# EAGLE design ModMoPSS - IR receiver (EAGLE 9.6.2)
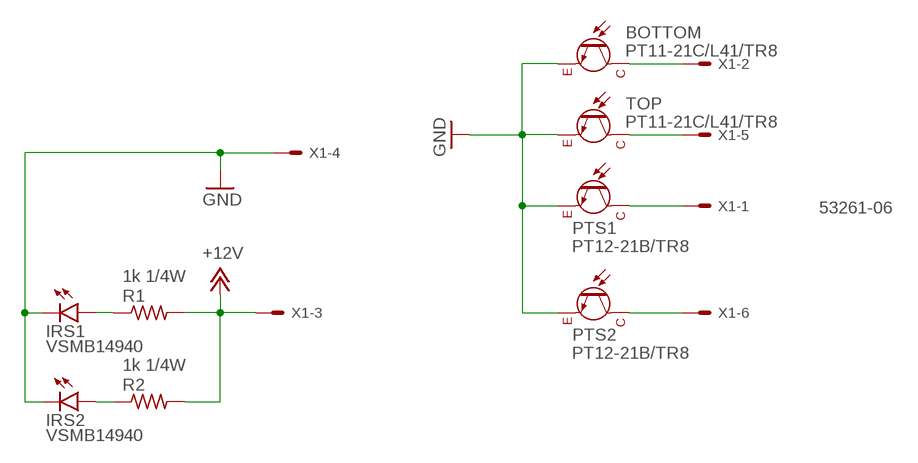
[diagram p0: schematic, sheet 1]

## Parts
BOTTOM  PT11-21C/L41/TR8  [CHIPLED_1206]
IRS1  VSMB14940  [VSMB14940]
IRS2  VSMB14940  [VSMB14940]
PTS1  PT12-21B/TR8  [PT12-21B/TR8]
PTS2  PT12-21B/TR8  [PT12-21B/TR8]
R1  1k 1/4W  R-US_R0805  [R0805]
R2  1k 1/4W  R-US_R0805  [R0805]
TOP  PT11-21C/L41/TR8  [CHIPLED_1206]
X1  53261-06  [53261-06]

## Nets
+12V: R1.2 R2.2 X1.3
GND: BOTTOM.A(E) IRS1.P$2(C) IRS2.P$2(C) PTS1.P$2(E) PTS2.P$2(E) TOP.A(E) X1.4
N$1: BOTTOM.C X1.2
N$2: PTS1.P$1(C) X1.1
N$3: TOP.C X1.5
N$4: IRS2.P$1(A) R2.1
N$5: PTS2.P$1(C) X1.6
N$7: IRS1.P$1(A) R1.1

## Library data of the parts
BOTTOM TOP = 000-my_library:PT11-21C/L41/TR8: IR photodiode 1206 jlcpcb
IRS1 IRS2 = 000-my_library:VSMB14940
PTS1 PTS2 = 000-my_library:PT12-21B/TR8
R1 R2 = rcl:R-US_: RESISTOR, American symbol; SPICEPREFIX: R
X1 = con-molex:53?-06: CONNECTOR wire to board 1.25 mm (.049 inch) pitch header; MF: MOLEX; OC_FARNELL: 1125375; OC_NEWARK: unknown

## Board
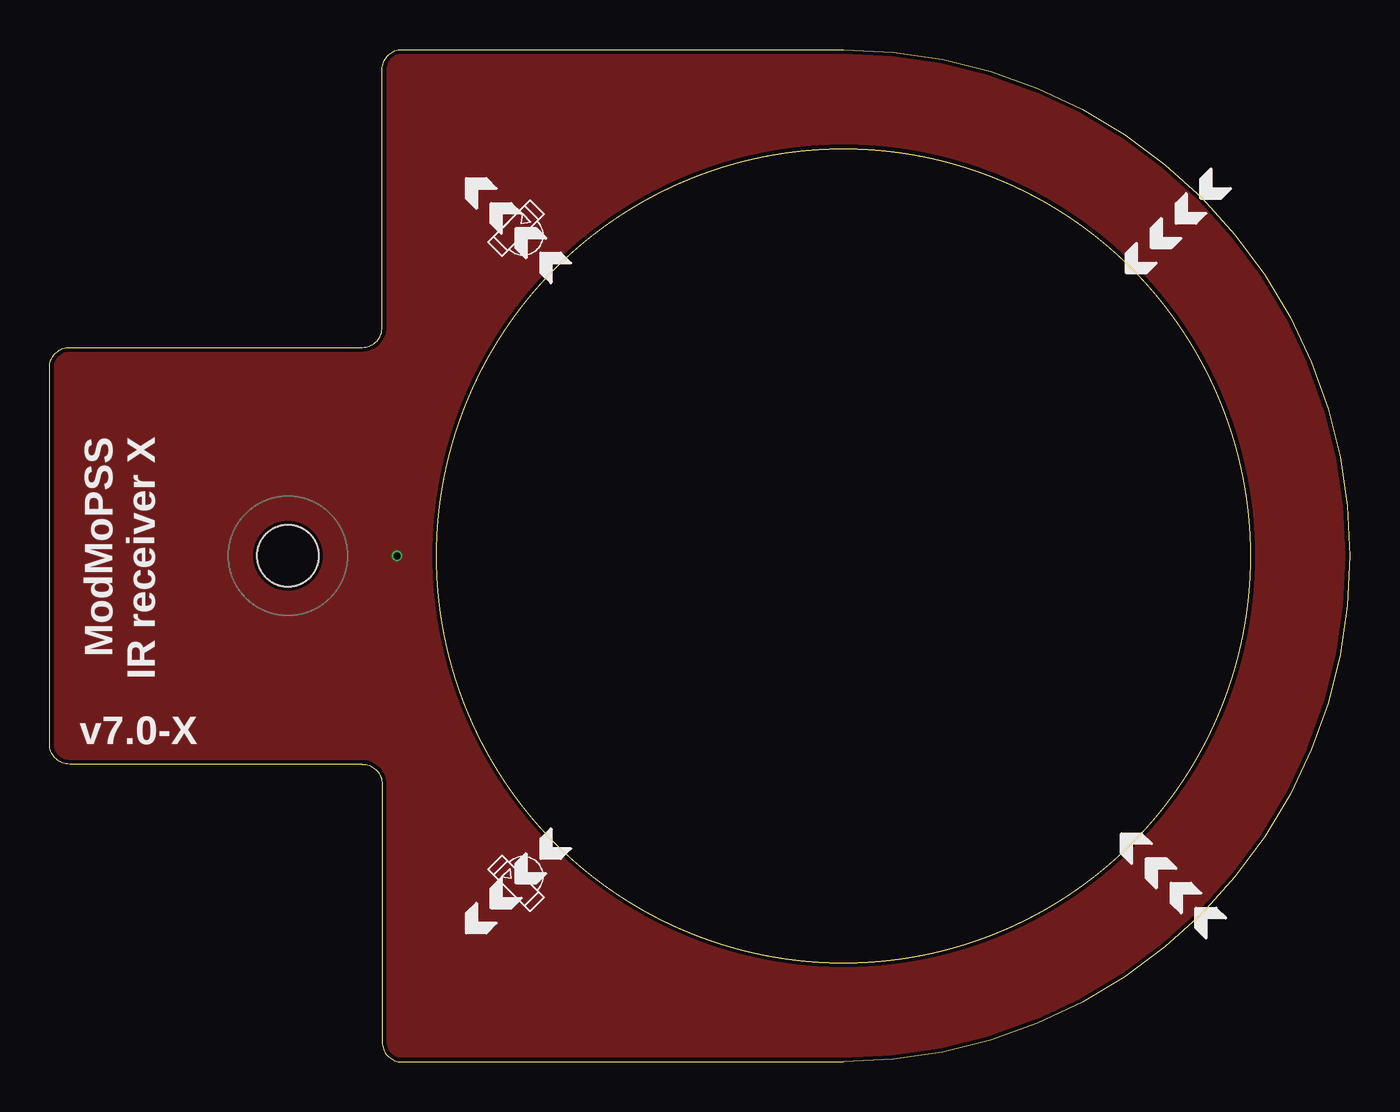
[diagram p1: board, top side]
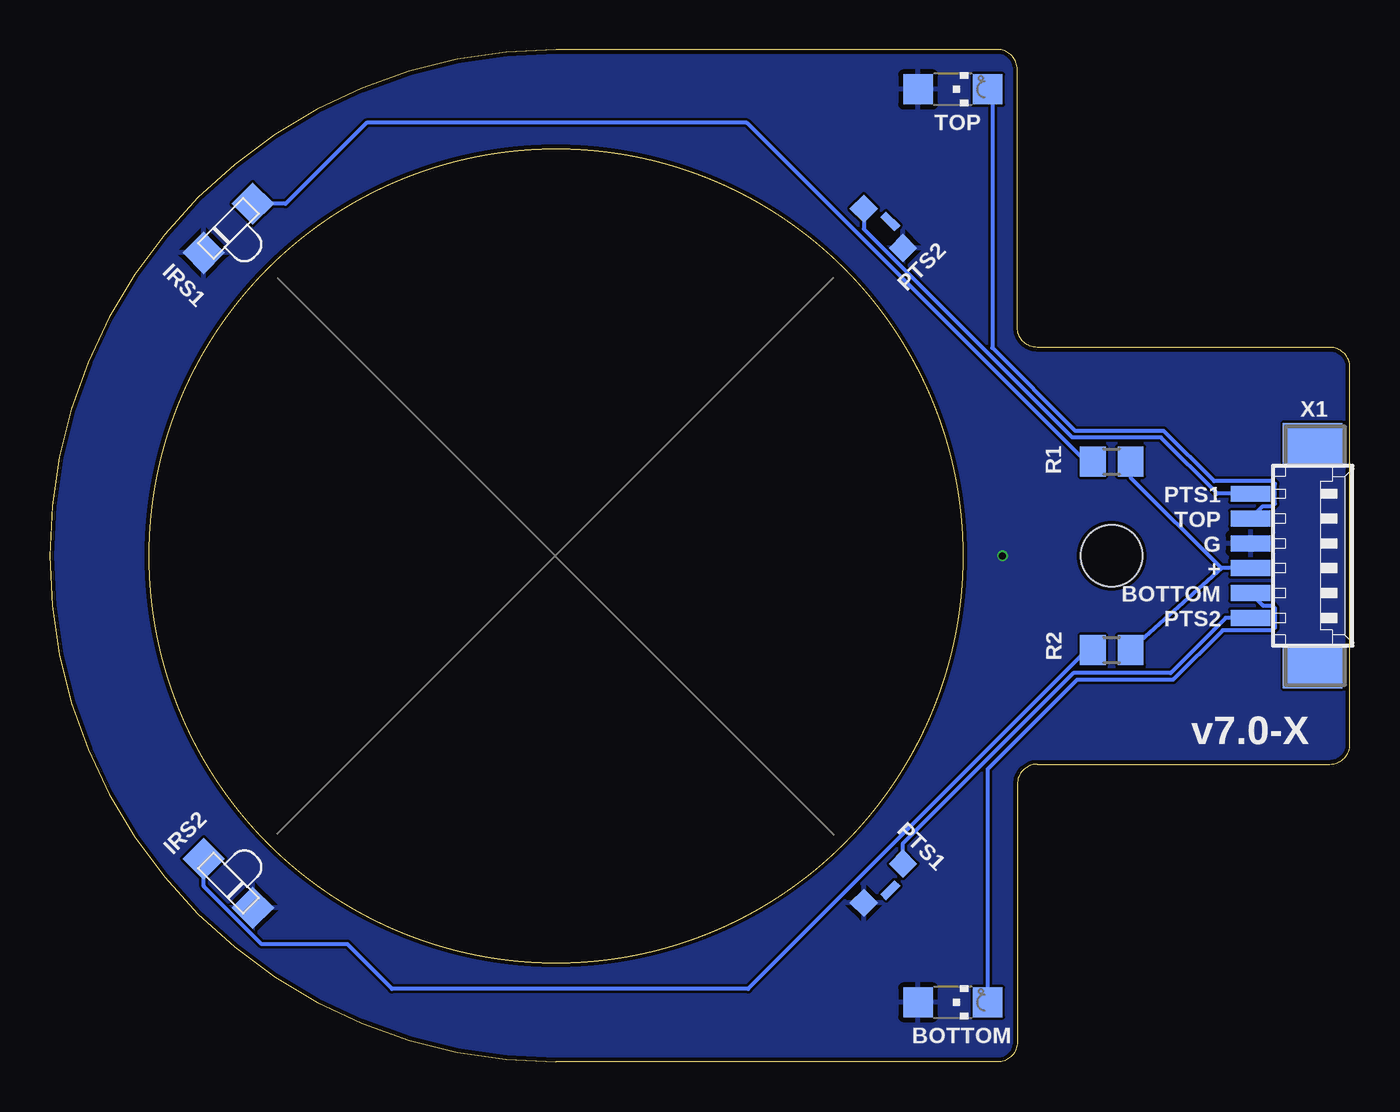
[diagram p2: board, bottom side, seen from below]

Size 65.5 x 51 mm. Coordinates in mm from the lower left corner, seen from the top.
Outline: 15.75,15 1,15 arc-90 0,16 0,35 arc-90 1,36 15.75,36 arc90 16.75,37 16.75,50 arc-90 17.75,51 40,51 arc-180 40,0 17.75,0 arc-90 16.75,1 16.75,14 arc90 15.75,15
Outline: circle at 40,25.5 radius 20.5
Copper layers (1*16): Top 0.035559375mm / dielectric 1.6mm / Bottom 0.035559375mm
Design rules "jlcpcb2layer": minimum track width 5mil, minimum drill 12mil, track to track 5mil, track to pad 5mil, pad to pad 5mil, via to via 5mil, smd to smd 5mil, copper to edge 8mil, drill to drill 6mil, minimum pad ring 5mil, minimum via ring 3mil, stop-mask expansion 2.5mil, vias tented up to drill 0mil, thermal gap 10mil
Holes 3.1 mm at 12,25.5

### Footprints (pad centres in the part's own frame; a part is rotated, then mirrored left to right if it is on the bottom)
CHIPLED_1206 = smd 1.5 x 1.5: A 0,-1.75; C 0,1.75
VSMB14940 = smd 1.5 x 1.5: P$1 -1.75,0; P$2 1.75,0
PT12-21B/TR8 = smd 1 x 1: P$1 1.4,0; P$2 -1.4,0 | smd 1 x 0.4: P$3 0,-0.5
R0805 = smd 1.3 x 1.5: 1 -0.95,0; 2 0.95,0
53261-06 = smd 0.8 x 2: 1 3.125,-2.5; 2 1.875,-2.5; 3 0.625,-2.5; 4 -0.625,-2.5; 5 -1.875,-2.5; 6 -3.125,-2.5 | smd 2.1 x 3: S1 5.625,0.625; S2 -5.625,0.625

### Placement (x,y rotation side)
BOTTOM  20,3 270 bottom
IRS1  56.5,42 225 bottom
IRS2  56.5,9 315 bottom
PTS1  23.5,9 45 bottom
PTS2  23.5,42 135 bottom
R1  12,30.25 0 bottom
R2  12,20.75 0 bottom
TOP  20,49 270 bottom
X1  2.5,25.5 270 bottom

### Tracks (layer width: path | path; a pad name or v marks a point on that pad's centre or on a via)
+12V
  Bottom 0.203: R2.2 6.45,24.88 X1.3 6.47,24.88 11.05,29.45 R1.2
GND  (via drill 0.35)
  other vias: 17.5,25.5
  pour Bottom: -0.74,-1.9 66.69,-1.9 66.69,52.95 -0.74,52.95
  pour Top: -1.25,53.31 -1.25,-2.26 67.06,-2.26 67.06,53.31
N$1
  Bottom 0.203: X1.2 4.38,23 3.9,23 3.77,22.87 3.77,21.88 3.9,21.75 6.41,21.75 8.91,19.25 13.75,19.25 18.25,14.75 BOTTOM.C
N$2
  Bottom 0.203: X1.1 6.25,22.38 9.03,19.59 13.94,19.59 22.51,11.02 PTS1.P$1
N$3
  Bottom 0.203: X1.5 4.38,28 3.9,28 3.77,28.13 3.77,29.12 3.9,29.25 6.84,29.25 9.38,31.79 13.82,31.79 18.02,35.98 18.02,48.77 TOP.C
N$4
  Bottom 0.203: R2.1 13.25,20.75 30.32,3.68 48.25,3.68 50.5,5.93 54.82,5.93 57.74,8.85 IRS2.P$1
N$5
  Bottom 0.203: X1.6 6.68,28.62 9.51,31.46 13.99,31.46 24.49,41.96 PTS2.P$1
N$7
  Bottom 0.203: IRS1.P$1 53.62,43.24 49.54,47.32 30.38,47.32 13.42,30.36 R1.1

### Text on the board
tNames: ModMoPSS / IR receiver X | v7.0-X
bNames: PTS1 | TOP | G | + | BOTTOM | PTS2 | v7.0-X